# Altium schematic sheet ModuleLamp.SchDoc
size A4
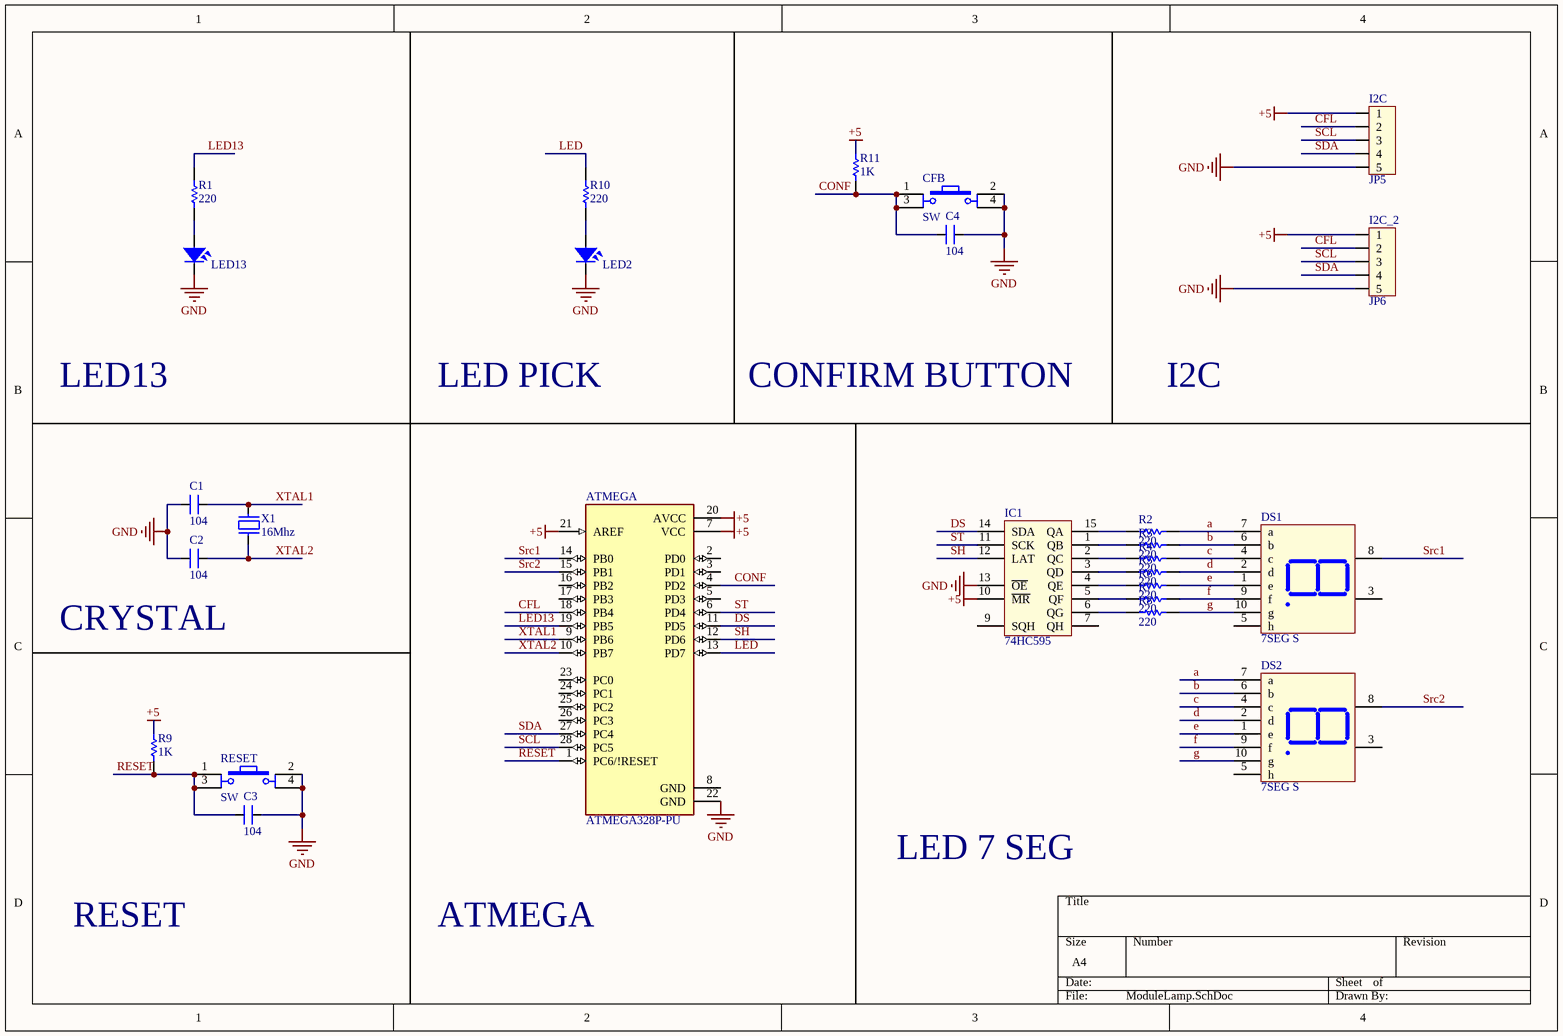
[diagram p0: ModuleLamp.SchDoc]

## Parts
ATMEGA  ATMEGA328P-PU  [DIP794W46P254L2967H457Q28B]
C1  104  [CN2]
C2  104  [CN2]
C3  104  [CN2]
C4  104  [CN2]
CFB  SW  [SW4]
DS1  7SEG S  [7SEGS]
DS2  7SEG S  [7SEGS]
I2C  JP5  [CON5]
I2C_2  JP6  [CON5]
IC1  74HC595  [DIP16/W0.3]
LED2  LED  [LED-5-Green]  (value not drawn)
LED13  LED  [LED-5-Green]  (value not drawn)
R1  value 220  [R1/4W]  (hidden comment: Res1)
R2  value 220  [R1/4W]  (hidden comment: Res1)
R3  value 220  [R1/4W]  (hidden comment: Res1)
R4  value 220  [R1/4W]  (hidden comment: Res1)
R5  value 220  [R1/4W]  (hidden comment: Res1)
R6  value 220  [R1/4W]  (hidden comment: Res1)
R7  value 220  [R1/4W]  (hidden comment: Res1)
R8  value 220  [R1/4W]  (hidden comment: Res1)
R9  value 1K  [R1/4W]  (hidden comment: Res1)
R10  value 220  [R1/4W]  (hidden comment: Res1)
R11  value 1K  [R1/4W]  (hidden comment: Res1)
RESET  SW  [SW4]
X1  16Mhz  [XT2]

## Nets
+5: ATMEGA.7(VCC) ATMEGA.20(AVCC) ATMEGA.21(AREF) I2C.1 I2C_2.1 IC1.10(~{MR}) R9.2 R11.2
GND: ATMEGA.22(GND) C1.1 C2.1 C3.2 C4.2 CFB.2 CFB.4 I2C.5 I2C_2.5 IC1.8(GND) IC1.13(~{OE}) LED2.2 LED13.2 RESET.2 RESET.4
VCC: IC1.16(VCC)
a: DS1.7(a) DS2.7(a) R2.1
b: DS1.6(b) DS2.6(b) R3.1
c: DS1.4(c) DS2.4(c) R4.1
CFL: ATMEGA.18(PB4) I2C.2 I2C_2.2
CONF: ATMEGA.4(PD2) C4.1 CFB.1 CFB.3 R11.1
d: DS1.2(d) DS2.2(d) R5.1
DS: ATMEGA.11(PD5) IC1.14(SDA)
e: DS1.1(e) DS2.1(e) R6.1
f: DS1.9(f) DS2.9(f) R7.1
g: DS1.10(g) DS2.10(g) R8.1
LED: ATMEGA.13(PD7) R10.1
LED13: ATMEGA.19(PB5) R1.1
RESET: ATMEGA.1(PC6/!RESET) C3.1 R9.1 RESET.1 RESET.3
SCL: ATMEGA.28(PC5) I2C.3 I2C_2.3
SDA: ATMEGA.27(PC4) I2C.4 I2C_2.4
SH: ATMEGA.12(PD6) IC1.12(LAT)
Src1: ATMEGA.14(PB0) DS1.8(Vcc)
Src2: ATMEGA.15(PB1) DS2.8(Vcc)
ST: ATMEGA.6(PD4) IC1.11(SCK)
XTAL1: ATMEGA.9(PB6) C1.2 X1.2
XTAL2: ATMEGA.10(PB7) C2.2 X1.1
NetIC1_1: IC1.1(QB) R3.2
NetIC1_2: IC1.2(QC) R4.2
NetIC1_3: IC1.3(QD) R5.2
NetIC1_4: IC1.4(QE) R6.2
NetIC1_5: IC1.5(QF) R7.2
NetIC1_6: IC1.6(QG) R8.2
NetIC1_15: IC1.15(QA) R2.2
NetLED2_1: LED2.1 R10.2
NetLED13_1: LED13.1 R1.2

Not connected (* = marked no-connect by the designer): ATMEGA 2(PD0) 3(PD1) 5(PD3) 8(GND) 16(PB2) 17(PB3) 23(PC0) 24(PC1) 25(PC2) 26(PC3); DS1 3(Vcc) 5(h); DS2 3(Vcc) 5(h); IC1 7(QH) 9(SQH)

## Notes on the sheet
- LED13
- LED PICK
- CONFIRM BUTTON
- I2C
- (near C2) CRYSTAL
- LED 7 SEG
- RESET
- ATMEGA

## Library data of the parts
ATMEGA = ATMEGA328P-PU: AVR AVRÂ® ATmega Microcontroller IC 8-Bit 20MHz 32KB _16K x 16_ FLASH 28-PDIP; MF: Microchip; Package: PDIP-28 Atmel; Value: *; Availability: Unavailable; SnapEDA_Link: https://www.snapeda.com/parts/ATMEGA328P-PU/Microchip/view-part/44282/?ref=snap; Price: None; MP: ATMEGA328P-PU
C1-C4 = CN2: Cap np 104 => 105pF; Value: 0.1uF
CFB RESET = SW4: Switch button 4 pin; Value: Button chip 4 pin
DS1 DS2 = LED7S: Single 7 Seg Dipslay; Value: LED 7S SEG
I2C I2C_2 = Con5: Connector 5; Value: Connector 5
IC1 = 74595: 8 Bit Serial input - Parallel Output; Value: 74HC595
LED2 LED13 = LED: LED Single colour Green and Red; Value: LED 3 ly Single Colour
R1-R11 = Res1_1: Resistor; Manufacturer: Generic Components; Class: Passive; Published: 08/06/2000; Publisher: Altium Hobart Technology Centre; SubClass: Resistor
X1 = XT2: Crystal For all Crystal 2pin.; Value: 4Mhz